# Altium schematic sheet FPGA_Banks_224_225_226_227_228.SchDoc: Sayma AMC
size 420 x 297 mm; $$Internal___BlkDate: 0:12:25_2-9-18; $$Internal_NAME_PLACEHOLDER: a3sheet; $$Internal_Resolution: 00001mm; $$NotCommonProperty_@NAME: FPGA_XCKU040FFVA1156; $$NotCommonProperty_@PRINTORDER: 21; $$NotCommonProperty_@SHEET: FPGA Banks 224 225 226 227 228; $$NotCommonProperty_@SHEETTOTAL: 30; CmpIndex: 924; Drawing Author: G.Kasprowicz; Drawing Number: Sayma AMC; Drawing Project: AMC FMC Carrier Board; Drawing Revision: 2.0; SymIndex: 2141; CheckedBy: P.Kulik,T.Przywozki,W.Ruclo; Author: G.Kasprowicz; CompanyName: WUT ISE; DrawnBy: G.Kasprowicz; Organization: WUT ISE; Address1: PW ISE; Address2: Nowowiejska 15/19 00-665 Warsaw; Address3: gkasprow@gmail.com; DocumentNumber: 29; Revision: 2; SheetNumber: 29; SheetTotal: 32; ModifiedBy: -; CheckedDate: -; Title2: FPGA GTH banks; DivGrp: WUT ISE; Designer: G.Kasprowicz; ModifiedDate: -; ProjectName: Sensor Box
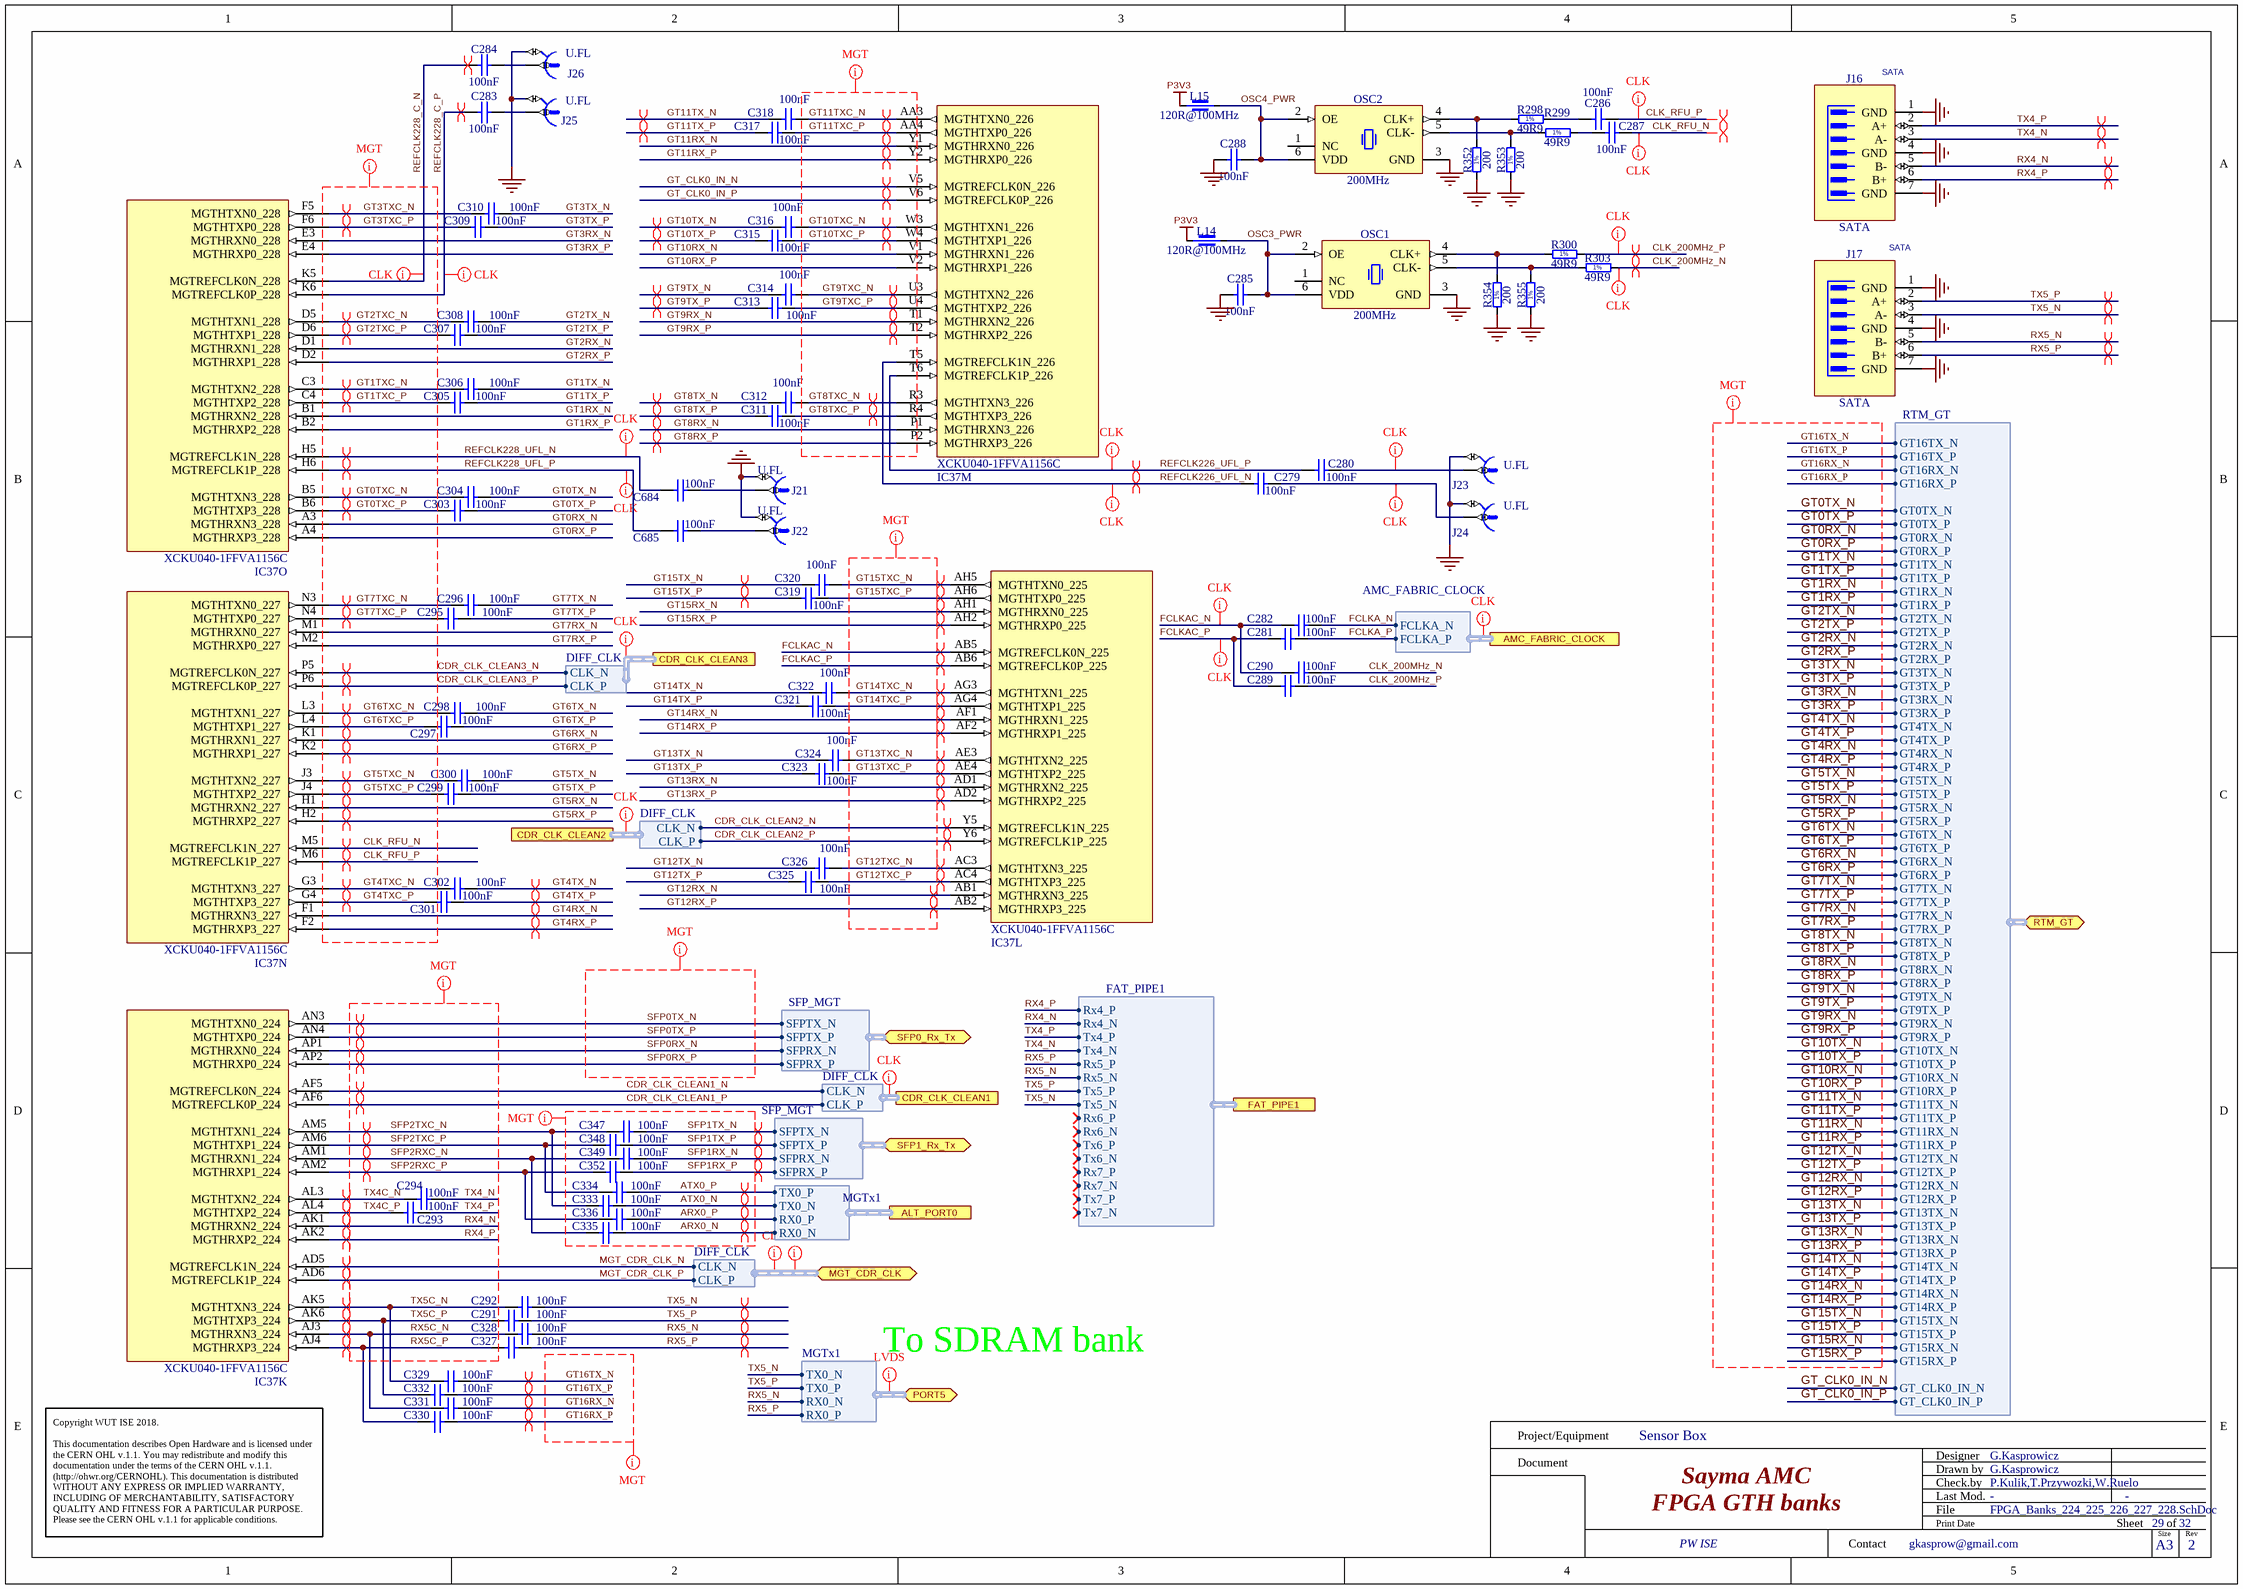
[diagram p0: FPGA_Banks_224_225_226_227_228.SchDoc]

## Parts
C279  100nF  [CAPC0603X33N]
C280  100nF  [CAPC0603X33N]
C281  100nF  [CAPC0603X33N]
C282  100nF  [CAPC0603X33N]
C283  100nF  [CAPC0603X33N]
C284  100nF  [CAPC0603X33N]
C285  100nF  [CAPC0603X33N]
C286  100nF  [CAPC0603X33N]
C287  100nF  [CAPC0603X33N]
C288  100nF  [CAPC0603X33N]
C289  100nF  [CAPC0603X33N]
C290  100nF  [CAPC0603X33N]
C291  100nF  [CAPC0603X33N]
C292  100nF  [CAPC0603X33N]
C293  100nF  [CAPC0603X33N]
C294  100nF  [CAPC0603X33N]
C295  100nF  [CAPC0603X33N]
C296  100nF  [CAPC0603X33N]
C297  100nF  [CAPC0603X33N]
C298  100nF  [CAPC0603X33N]
C299  100nF  [CAPC0603X33N]
C300  100nF  [CAPC0603X33N]
C301  100nF  [CAPC0603X33N]
C302  100nF  [CAPC0603X33N]
C303  100nF  [CAPC0603X33N]
C304  100nF  [CAPC0603X33N]
C305  100nF  [CAPC0603X33N]
C306  100nF  [CAPC0603X33N]
C307  100nF  [CAPC0603X33N]
C308  100nF  [CAPC0603X33N]
C309  100nF  [CAPC0603X33N]
C310  100nF  [CAPC0603X33N]
C311  100nF  [CAPC0603X33N]
C312  100nF  [CAPC0603X33N]
C313  100nF  [CAPC0603X33N]
C314  100nF  [CAPC0603X33N]
C315  100nF  [CAPC0603X33N]
C316  100nF  [CAPC0603X33N]
C317  100nF  [CAPC0603X33N]
C318  100nF  [CAPC0603X33N]
C319  100nF  [CAPC0603X33N]
C320  100nF  [CAPC0603X33N]
C321  100nF  [CAPC0603X33N]
C322  100nF  [CAPC0603X33N]
C323  100nF  [CAPC0603X33N]
C324  100nF  [CAPC0603X33N]
C325  100nF  [CAPC0603X33N]
C326  100nF  [CAPC0603X33N]
C327  100nF  [CAPC0603X33N]
C328  100nF  [CAPC0603X33N]
C329  100nF  [CAPC0603X33N]
C330  100nF  [CAPC0603X33N]
C331  100nF  [CAPC0603X33N]
C332  100nF  [CAPC0603X33N]
C333  100nF  [CAPC0603X33N]
C334  100nF  [CAPC0603X33N]
C335  100nF  [CAPC0603X33N]
C336  100nF  [CAPC0603X33N]
C347  100nF  [CAPC0603X33N]
C348  100nF  [CAPC0603X33N]
C349  100nF  [CAPC0603X33N]
C352  100nF  [CAPC0603X33N]
C684  100nF  [CAPC1005X55N]
C685  100nF  [CAPC1005X55N]
IC37  XCKU040-1FFVA1156C  [BGA1156C100P34X34_3500X3500X350]  (parts K,L,M,N,O of 22)
J16  SATA  [MOLEX_67800-5005]
J17  SATA  [MOLEX_67800-5005]
J21  U.FL  [HIROSE_U.FL-R-SMT-1(10)]
J22  U.FL  [HIROSE_U.FL-R-SMT-1(10)]
J23  U.FL  [HIROSE_U.FL-R-SMT-1(10)]
J24  U.FL  [HIROSE_U.FL-R-SMT-1(10)]
J25  U.FL  [HIROSE_U.FL-R-SMT-1(10)]
J26  U.FL  [HIROSE_U.FL-R-SMT-1(10)]
L14  120R@100MHz  [INDC1005X55N]
L15  120R@100MHz  [INDC1005X55N]
OSC1  200MHz  [OSC_SILICON-LAB_SI510-6N(5X7)]
OSC2  200MHz  [OSC_SILICON-LAB_SI510-6N(5X7)]
R298  49R9  [RESC1005X40N]
R299  49R9  [RESC1005X40N]
R300  49R9  [RESC1005X40N]
R303  49R9  [RESC1005X40N]
R352  200  [RESC1005X40N]
R353  200  [RESC1005X40N]
R354  200  [RESC1005X40N]
R355  200  [RESC1005X40N]

## Ports
ALT_PORT0 (harness MGTx1), AMC_FABRIC_CLOCK (harness AMC_FABRIC_CLOCK), CDR_CLK_CLEAN1 (harness DIFF_CLK), CDR_CLK_CLEAN2 (harness DIFF_CLK), CDR_CLK_CLEAN3 (harness DIFF_CLK), FAT_PIPE1 (harness FAT_PIPE1), MGT_CDR_CLK (bidir, harness DIFF_CLK), PORT5 (bidir, harness MGTx1), RTM_GT (bidir, harness RTM_GT), SFP0_Rx_Tx (bidir, harness SFP_MGT), SFP1_Rx_Tx (bidir, harness SFP_MGT)

## Harnesses
SFP_MGT: SFPRX_P, SFPRX_N, SFPTX_P, SFPTX_N
FAT_PIPE1: Rx4_P, Rx4_N, Tx4_N, Tx4_P, Rx5_P, Rx5_N, Tx5_N, Tx5_P, Rx6_P, Rx6_N, Tx6_P, Rx7_P, Rx7_N, Tx7_P, Tx6_N, Tx7_N
AMC_FABRIC_CLOCK: FCLKA_N, FCLKA_P
RTM_GT: GT0TX_N, GT0TX_P, GT0RX_N, GT0RX_P, GT1TX_N, GT1TX_P, GT1RX_N, GT1RX_P, GT2TX_N, GT2TX_P, GT2RX_N, GT2RX_P, GT3TX_N, GT3TX_P, GT3RX_N, GT3RX_P, GT4TX_N, GT4TX_P, GT4RX_N, GT4RX_P, GT5TX_N, GT5TX_P, GT5RX_N, GT5RX_P, GT6TX_N, GT6TX_P, GT6RX_N, GT6RX_P, GT7TX_N, GT7TX_P, GT7RX_N, GT7RX_P, GT8TX_N, GT8TX_P, GT8RX_N, GT8RX_P, GT9TX_N, GT9TX_P, GT9RX_N, GT9RX_P, GT10TX_N, GT10TX_P, GT10RX_N, GT10RX_P, GT11TX_N, GT11TX_P, GT11RX_N, GT11RX_P, GT12TX_N, GT12TX_P, GT12RX_N, GT12RX_P, GT13TX_N, GT13TX_P, GT13RX_N, GT13RX_P, GT14TX_N, GT14TX_P, GT14RX_N, GT14RX_P, GT15TX_N, GT15TX_P, GT15RX_N, GT15RX_P, GT_CLK0_IN_N, GT_CLK0_IN_P, GT16TX_N, GT16TX_P, GT16RX_N, GT16RX_P
DIFF_CLK: CLK_N, CLK_P
MGTx1: RX0_P, RX0_N, TX0_P, TX0_N
DIFF_CLK: CLK_P, CLK_N

## Nets
GND: C285.1 C288.1 J16.1(GND) J16.4(GND) J16.7(GND) J17.1(GND) J17.4(GND) J17.7(GND) J21.2 J22.2 J23.2 J24.2 J25.2 J26.2 OSC1.3(GND) OSC2.3(GND) R352.1 R353.1 R354.1 R355.1
P3V3: L14.2 L15.2
ARX0_N: C335.2 ; port ALT_PORT0.RX0_N
ARX0_P: C336.2 ; port ALT_PORT0.RX0_P
ATX0_N: C333.2 ; port ALT_PORT0.TX0_N
ATX0_P: C334.2 ; port ALT_PORT0.TX0_P
CDR_CLK_CLEAN1_N: IC37.AF5(MGTREFCLK0N_224) ; port CDR_CLK_CLEAN1.CLK_N
CDR_CLK_CLEAN1_P: IC37.AF6(MGTREFCLK0P_224) ; port CDR_CLK_CLEAN1.CLK_P
CDR_CLK_CLEAN2_N: IC37.Y5(MGTREFCLK1N_225) ; port CDR_CLK_CLEAN2.CLK_N
CDR_CLK_CLEAN2_P: IC37.Y6(MGTREFCLK1P_225) ; port CDR_CLK_CLEAN2.CLK_P
CDR_CLK_CLEAN3_N: IC37.P5(MGTREFCLK0N_227) ; port CDR_CLK_CLEAN3.CLK_N
CDR_CLK_CLEAN3_P: IC37.P6(MGTREFCLK0P_227) ; port CDR_CLK_CLEAN3.CLK_P
CLK_200MHz_N: C290.2 R303.2
CLK_200MHz_P: C289.2 R300.2
CLK_RFU_N: C287.2 IC37.M5(MGTREFCLK1N_227)
CLK_RFU_P: C286.2 IC37.M6(MGTREFCLK1P_227)
FCLKA_N: C282.2 ; port AMC_FABRIC_CLOCK.FCLKA_N
FCLKA_P: C281.2 ; port AMC_FABRIC_CLOCK.FCLKA_P
FCLKAC_N: C282.1 C290.1 IC37.AB5(MGTREFCLK0N_225)
FCLKAC_P: C281.1 C289.1 IC37.AB6(MGTREFCLK0P_225)
GT0RX_N: IC37.A3(MGTHRXN3_228) ; port RTM_GT.GT0RX_N
GT0RX_P: IC37.A4(MGTHRXP3_228) ; port RTM_GT.GT0RX_P
GT0TX_N: C304.2 ; port RTM_GT.GT0TX_N
GT0TX_P: C303.2 ; port RTM_GT.GT0TX_P
GT0TXC_N: C304.1 IC37.B5(MGTHTXN3_228)
GT0TXC_P: C303.1 IC37.B6(MGTHTXP3_228)
GT1RX_N: IC37.B1(MGTHRXN2_228) ; port RTM_GT.GT1RX_N
GT1RX_P: IC37.B2(MGTHRXP2_228) ; port RTM_GT.GT1RX_P
GT1TX_N: C306.2 ; port RTM_GT.GT1TX_N
GT1TX_P: C305.2 ; port RTM_GT.GT1TX_P
GT1TXC_N: C306.1 IC37.C3(MGTHTXN2_228)
GT1TXC_P: C305.1 IC37.C4(MGTHTXP2_228)
GT2RX_N: IC37.D1(MGTHRXN1_228) ; port RTM_GT.GT2RX_N
GT2RX_P: IC37.D2(MGTHRXP1_228) ; port RTM_GT.GT2RX_P
GT2TX_N: C308.2 ; port RTM_GT.GT2TX_N
GT2TX_P: C307.2 ; port RTM_GT.GT2TX_P
GT2TXC_N: C308.1 IC37.D5(MGTHTXN1_228)
GT2TXC_P: C307.1 IC37.D6(MGTHTXP1_228)
GT3RX_N: IC37.E3(MGTHRXN0_228) ; port RTM_GT.GT3RX_N
GT3RX_P: IC37.E4(MGTHRXP0_228) ; port RTM_GT.GT3RX_P
GT3TX_N: C310.2 ; port RTM_GT.GT3TX_N
GT3TX_P: C309.2 ; port RTM_GT.GT3TX_P
GT3TXC_N: C310.1 IC37.F5(MGTHTXN0_228)
GT3TXC_P: C309.1 IC37.F6(MGTHTXP0_228)
GT4RX_N: IC37.F1(MGTHRXN3_227) ; port RTM_GT.GT4RX_N
GT4RX_P: IC37.F2(MGTHRXP3_227) ; port RTM_GT.GT4RX_P
GT4TX_N: C302.2 ; port RTM_GT.GT4TX_N
GT4TX_P: C301.2 ; port RTM_GT.GT4TX_P
GT4TXC_N: C302.1 IC37.G3(MGTHTXN3_227)
GT4TXC_P: C301.1 IC37.G4(MGTHTXP3_227)
GT5RX_N: IC37.H1(MGTHRXN2_227) ; port RTM_GT.GT5RX_N
GT5RX_P: IC37.H2(MGTHRXP2_227) ; port RTM_GT.GT5RX_P
GT5TX_N: C300.2 ; port RTM_GT.GT5TX_N
GT5TX_P: C299.2 ; port RTM_GT.GT5TX_P
GT5TXC_N: C300.1 IC37.J3(MGTHTXN2_227)
GT5TXC_P: C299.1 IC37.J4(MGTHTXP2_227)
GT6RX_N: IC37.K1(MGTHRXN1_227) ; port RTM_GT.GT6RX_N
GT6RX_P: IC37.K2(MGTHRXP1_227) ; port RTM_GT.GT6RX_P
GT6TX_N: C298.2 ; port RTM_GT.GT6TX_N
GT6TX_P: C297.2 ; port RTM_GT.GT6TX_P
GT6TXC_N: C298.1 IC37.L3(MGTHTXN1_227)
GT6TXC_P: C297.1 IC37.L4(MGTHTXP1_227)
GT7RX_N: IC37.M1(MGTHRXN0_227) ; port RTM_GT.GT7RX_N
GT7RX_P: IC37.M2(MGTHRXP0_227) ; port RTM_GT.GT7RX_P
GT7TX_N: C296.2 ; port RTM_GT.GT7TX_N
GT7TX_P: C295.2 ; port RTM_GT.GT7TX_P
GT7TXC_N: C296.1 IC37.N3(MGTHTXN0_227)
GT7TXC_P: C295.1 IC37.N4(MGTHTXP0_227)
GT8RX_N: IC37.P1(MGTHRXN3_226) ; port RTM_GT.GT8RX_N
GT8RX_P: IC37.P2(MGTHRXP3_226) ; port RTM_GT.GT8RX_P
GT8TX_N: C312.1 ; port RTM_GT.GT8TX_N
GT8TX_P: C311.1 ; port RTM_GT.GT8TX_P
GT8TXC_N: C312.2 IC37.R3(MGTHTXN3_226)
GT8TXC_P: C311.2 IC37.R4(MGTHTXP3_226)
GT9RX_N: IC37.T1(MGTHRXN2_226) ; port RTM_GT.GT9RX_N
GT9RX_P: IC37.T2(MGTHRXP2_226) ; port RTM_GT.GT9RX_P
GT9TX_N: C314.1 ; port RTM_GT.GT9TX_N
GT9TX_P: C313.1 ; port RTM_GT.GT9TX_P
GT9TXC_N: C314.2 IC37.U3(MGTHTXN2_226)
GT9TXC_P: C313.2 IC37.U4(MGTHTXP2_226)
GT10RX_N: IC37.V1(MGTHRXN1_226) ; port RTM_GT.GT10RX_N
GT10RX_P: IC37.V2(MGTHRXP1_226) ; port RTM_GT.GT10RX_P
GT10TX_N: C316.1 ; port RTM_GT.GT10TX_N
GT10TX_P: C315.1 ; port RTM_GT.GT10TX_P
GT10TXC_N: C316.2 IC37.W3(MGTHTXN1_226)
GT10TXC_P: C315.2 IC37.W4(MGTHTXP1_226)
GT11RX_N: IC37.Y1(MGTHRXN0_226) ; port RTM_GT.GT11RX_N
GT11RX_P: IC37.Y2(MGTHRXP0_226) ; port RTM_GT.GT11RX_P
GT11TX_N: C318.1 ; port RTM_GT.GT11TX_N
GT11TX_P: C317.1 ; port RTM_GT.GT11TX_P
GT11TXC_N: C318.2 IC37.AA3(MGTHTXN0_226)
GT11TXC_P: C317.2 IC37.AA4(MGTHTXP0_226)
GT12RX_N: IC37.AB1(MGTHRXN3_225) ; port RTM_GT.GT12RX_N
GT12RX_P: IC37.AB2(MGTHRXP3_225) ; port RTM_GT.GT12RX_P
GT12TX_N: C326.1 ; port RTM_GT.GT12TX_N
GT12TX_P: C325.1 ; port RTM_GT.GT12TX_P
GT12TXC_N: C326.2 IC37.AC3(MGTHTXN3_225)
GT12TXC_P: C325.2 IC37.AC4(MGTHTXP3_225)
GT13RX_N: IC37.AD1(MGTHRXN2_225) ; port RTM_GT.GT13RX_N
GT13RX_P: IC37.AD2(MGTHRXP2_225) ; port RTM_GT.GT13RX_P
GT13TX_N: C324.1 ; port RTM_GT.GT13TX_N
GT13TX_P: C323.1 ; port RTM_GT.GT13TX_P
GT13TXC_N: C324.2 IC37.AE3(MGTHTXN2_225)
GT13TXC_P: C323.2 IC37.AE4(MGTHTXP2_225)
GT14RX_N: IC37.AF1(MGTHRXN1_225) ; port RTM_GT.GT14RX_N
GT14RX_P: IC37.AF2(MGTHRXP1_225) ; port RTM_GT.GT14RX_P
GT14TX_N: C322.1 ; port RTM_GT.GT14TX_N
GT14TX_P: C321.1 ; port RTM_GT.GT14TX_P
GT14TXC_N: C322.2 IC37.AG3(MGTHTXN1_225)
GT14TXC_P: C321.2 IC37.AG4(MGTHTXP1_225)
GT15RX_N: IC37.AH1(MGTHRXN0_225) ; port RTM_GT.GT15RX_N
GT15RX_P: IC37.AH2(MGTHRXP0_225) ; port RTM_GT.GT15RX_P
GT15TX_N: C320.1 ; port RTM_GT.GT15TX_N
GT15TX_P: C319.1 ; port RTM_GT.GT15TX_P
GT15TXC_N: C320.2 IC37.AH5(MGTHTXN0_225)
GT15TXC_P: C319.2 IC37.AH6(MGTHTXP0_225)
GT16RX_N: C331.2 ; port RTM_GT.GT16RX_N
GT16RX_P: C330.2 ; port RTM_GT.GT16RX_P
GT16TX_N: C329.2 ; port RTM_GT.GT16TX_N
GT16TX_P: C332.2 ; port RTM_GT.GT16TX_P
GT_CLK0_IN_N: IC37.V5(MGTREFCLK0N_226) ; port RTM_GT.GT_CLK0_IN_N
GT_CLK0_IN_P: IC37.V6(MGTREFCLK0P_226) ; port RTM_GT.GT_CLK0_IN_P
MGT_CDR_CLK_N: IC37.AD5(MGTREFCLK1N_224) ; port MGT_CDR_CLK.CLK_N
MGT_CDR_CLK_P: IC37.AD6(MGTREFCLK1P_224) ; port MGT_CDR_CLK.CLK_P
OSC3_PWR: C285.2 L14.1 OSC1.2(OE) OSC1.6(VDD)
OSC4_PWR: C288.2 L15.1 OSC2.2(OE) OSC2.6(VDD)
REFCLK226_UFL_N: C279.1 IC37.T5(MGTREFCLK1N_226)
REFCLK226_UFL_P: C280.1 IC37.T6(MGTREFCLK1P_226)
REFCLK228_C_N: C284.1 IC37.K5(MGTREFCLK0N_228)
REFCLK228_C_P: C283.1 IC37.K6(MGTREFCLK0P_228)
REFCLK228_UFL_N: C684.2 IC37.H5(MGTREFCLK1N_228)
REFCLK228_UFL_P: C685.2 IC37.H6(MGTREFCLK1P_228)
RX4_N: IC37.AK1(MGTHRXN2_224) J16.5(B-) ; port FAT_PIPE1.Rx4_N
RX4_P: IC37.AK2(MGTHRXP2_224) J16.6(B+) ; port FAT_PIPE1.Rx4_P
RX5_N: C328.2 J17.5(B-) ; port FAT_PIPE1.Rx5_N, port PORT5.RX0_N
RX5_P: C327.2 J17.6(B+) ; port FAT_PIPE1.Rx5_P, port PORT5.RX0_P
RX5C_N: C328.1 C331.1 IC37.AJ3(MGTHRXN3_224)
RX5C_P: C327.1 C330.1 IC37.AJ4(MGTHRXP3_224)
SFP0RX_N: IC37.AP1(MGTHRXN0_224) ; port SFP0_Rx_Tx.SFPRX_N
SFP0RX_P: IC37.AP2(MGTHRXP0_224) ; port SFP0_Rx_Tx.SFPRX_P
SFP0TX_N: IC37.AN3(MGTHTXN0_224) ; port SFP0_Rx_Tx.SFPTX_N
SFP0TX_P: IC37.AN4(MGTHTXP0_224) ; port SFP0_Rx_Tx.SFPTX_P
SFP1RX_N: C349.2 ; port SFP1_Rx_Tx.SFPRX_N
SFP1RX_P: C352.2 ; port SFP1_Rx_Tx.SFPRX_P
SFP1TX_N: C347.2 ; port SFP1_Rx_Tx.SFPTX_N
SFP1TX_P: C348.2 ; port SFP1_Rx_Tx.SFPTX_P
SFP2RXC_N: C335.1 C349.1 IC37.AM1(MGTHRXN1_224)
SFP2RXC_P: C336.1 C352.1 IC37.AM2(MGTHRXP1_224)
SFP2TXC_N: C333.1 C347.1 IC37.AM5(MGTHTXN1_224)
SFP2TXC_P: C334.1 C348.1 IC37.AM6(MGTHTXP1_224)
TX4_N: C294.2 J16.3(A-) ; port FAT_PIPE1.Tx4_N
TX4_P: C293.2 J16.2(A+) ; port FAT_PIPE1.Tx4_P
TX4C_N: C294.1 IC37.AL3(MGTHTXN2_224)
TX4C_P: C293.1 IC37.AL4(MGTHTXP2_224)
TX5_N: C292.2 J17.3(A-) ; port FAT_PIPE1.Tx5_N, port PORT5.TX0_N
TX5_P: C291.2 J17.2(A+) ; port FAT_PIPE1.Tx5_P, port PORT5.TX0_P
TX5C_N: C292.1 C329.1 IC37.AK5(MGTHTXN3_224)
TX5C_P: C291.1 C332.1 IC37.AK6(MGTHTXP3_224)
NetC279_2: C279.2 J24.1
NetC280_2: C280.2 J23.1
NetC283_2: C283.2 J25.1
NetC284_2: C284.2 J26.1
NetC286_1: C286.1 R298.2
NetC287_1: C287.1 R299.2
NetC684_1: C684.1 J21.1
NetC685_1: C685.1 J22.1
NetOSC1_4: OSC1.4(CLK+) R300.1 R354.2
NetOSC1_5: OSC1.5(CLK-) R303.1 R355.2
NetOSC2_4: OSC2.4(CLK+) R298.1 R352.2
NetOSC2_5: OSC2.5(CLK-) R299.1 R353.2

Not connected (* = marked no-connect by the designer): OSC1 1(NC); OSC2 1(NC)

## Layout directives
differential pair: ARX0_N, ARX0_P, ATX0_N, ATX0_P, CDR_CLK_CLEAN1_N, CDR_CLK_CLEAN1_P, CDR_CLK_CLEAN2_N, CDR_CLK_CLEAN2_P, CDR_CLK_CLEAN3_N, CDR_CLK_CLEAN3_P, CLK_200MHz_N, CLK_200MHz_P, CLK_RFU_N, CLK_RFU_P, FCLKAC_N, FCLKAC_P, GT0TXC_N, GT0TXC_P, GT1TXC_N, GT1TXC_P, GT2TXC_N, GT2TXC_P, GT3TXC_N, GT3TXC_P, GT4RX_N, GT4RX_P, GT4TX_N, GT4TX_P, GT4TXC_N, GT4TXC_P, GT5RX_N, GT5RX_P, GT5TXC_N, GT5TXC_P, GT6RX_N, GT6RX_P, GT6TXC_N, GT6TXC_P, GT7TXC_N, GT7TXC_P, GT8RX_N, GT8RX_P, GT8TX_N, GT8TX_P, GT8TXC_N, GT8TXC_P, GT9RX_N, GT9RX_P, GT9TX_N, GT9TX_P, GT9TXC_N, GT9TXC_P, GT10TX_N, GT10TX_P, GT10TXC_N, GT10TXC_P, GT11RX_N, GT11RX_P, GT11TX_N, GT11TX_P, GT11TXC_N, GT11TXC_P, GT12RX_N, GT12RX_P, GT12TXC_N, GT12TXC_P, GT13RX_N, GT13RX_P, GT13TXC_N, GT13TXC_P, GT14RX_N, GT14RX_P, GT14TXC_N, GT14TXC_P, GT15RX_N, GT15RX_P, GT15TX_N, GT15TX_P, GT15TXC_N, GT15TXC_P, GT16RX_N, GT16RX_P, GT16TX_N, GT16TX_P, GT_CLK0_IN_N, GT_CLK0_IN_P, MGT_CDR_CLK_N, MGT_CDR_CLK_P, REFCLK226_UFL_N, REFCLK226_UFL_P, REFCLK228_C_N, REFCLK228_C_P, REFCLK228_UFL_N, REFCLK228_UFL_P, RX4_N, RX4_P, RX5_N, RX5_P, RX5C_N, RX5C_P, SFP0RX_N, SFP0RX_P, SFP0TX_N, SFP0TX_P, SFP1RX_N, SFP1RX_P, SFP1TX_N, SFP1TX_P, SFP2RXC_N, SFP2RXC_P, SFP2TXC_N, SFP2TXC_P, TX4_N, TX4_P, TX4C_N, TX4C_P, TX5_N, TX5_P, TX5C_N, TX5C_P
net class MGT: ARX0_N, ARX0_P, ATX0_N, ATX0_P, CDR_CLK_CLEAN3_N, CDR_CLK_CLEAN3_P, CLK_RFU_N, CLK_RFU_P, GT0RX_N, GT0RX_P, GT0TX_N, GT0TX_P, GT0TXC_N, GT0TXC_P, GT1RX_N, GT1RX_P, GT1TX_N, GT1TX_P, GT1TXC_N, GT1TXC_P, GT2RX_N, GT2RX_P, GT2TX_N, GT2TX_P, GT2TXC_N, GT2TXC_P, GT3RX_N, GT3RX_P, GT3TX_N, GT3TX_P, GT3TXC_N, GT3TXC_P, GT4RX_N, GT4RX_P, GT4TX_N, GT4TX_P, GT4TXC_N, GT4TXC_P, GT5RX_N, GT5RX_P, GT5TX_N, GT5TX_P, GT5TXC_N, GT5TXC_P, GT6RX_N, GT6RX_P, GT6TX_N, GT6TX_P, GT6TXC_N, GT6TXC_P, GT7RX_N, GT7RX_P, GT7TX_N, GT7TX_P, GT7TXC_N, GT7TXC_P, GT8RX_N, GT8RX_P, GT8TX_N, GT8TX_P, GT8TXC_N, GT8TXC_P, GT9RX_N, GT9RX_P, GT9TX_N, GT9TX_P, GT9TXC_N, GT9TXC_P, GT10RX_N, GT10RX_P, GT10TX_N, GT10TX_P, GT10TXC_N, GT10TXC_P, GT11RX_N, GT11RX_P, GT11TX_N, GT11TX_P, GT11TXC_N, GT11TXC_P, GT12RX_N, GT12RX_P, GT12TX_N, GT12TX_P, GT12TXC_N, GT12TXC_P, GT13RX_N, GT13RX_P, GT13TX_N, GT13TX_P, GT13TXC_N, GT13TXC_P, GT14RX_N, GT14RX_P, GT14TX_N, GT14TX_P, GT14TXC_N, GT14TXC_P, GT15RX_N, GT15RX_P, GT15TX_N, GT15TX_P, GT15TXC_N, GT15TXC_P, GT16RX_N, GT16RX_P, GT16TX_N, GT16TX_P, RX4_N, RX4_P, RX5C_N, RX5C_P, SFP0RX_N, SFP0RX_P, SFP0TX_N, SFP0TX_P, SFP1RX_N, SFP1RX_P, SFP1TX_N, SFP1TX_P, SFP2RXC_N, SFP2RXC_P, SFP2TXC_N, SFP2TXC_P, TX4_N, TX4_P, TX4C_N, TX4C_P, TX5C_N, TX5C_P
net class LVDS: (no net found under the mark)
net class CLK: (no net found under the mark), CLK_200MHz_N, CLK_200MHz_P, CLK_RFU_N, CLK_RFU_P, FCLKAC_N, FCLKAC_P, NetC279_2, NetC280_2, REFCLK226_UFL_N, REFCLK226_UFL_P, REFCLK228_C_N, REFCLK228_C_P, REFCLK228_UFL_N, REFCLK228_UFL_P

## Notes on the sheet
- (near J16) SATA
- SATA
- To SDRAM bank
- Project/Equipment
- Document
- Designer
- Drawn by
- Check.by
- Copyright WUT ISE 2018.
  This documentation describes Open Hardware and is licensed under the CERN OHL v.1.1. You may redistribute and modify this documentation under the terms of the CERN OHL v.1.1. (http://ohwr.org/CERNOHL). This documentation is distributed WITHOUT ANY EXPRESS OR IMPLIED WARRANTY, INCLUDING OF MERCHANTABILITY, SATISFACTORY QUALITY AND FITNESS FOR A PARTICULAR PURPOSE. Please see the CERN OHL v.1.1 for applicable conditions.
- Contact
- File
- Last Mod.
- Print Date
- Sheet
- Size
- A3
- of
- Rev
- (in symbol R0402_49R9_1%_0.0625W_100PPM) 1%
- (in symbol R0402_200R_1%_0.0625W_100PPM) 1%

## Library data of the parts
C279-C336 C347-C349 C352 = CC0201_100NF_6.3V_10%_X5R: Non-polarised capacitor; Manufacturer: GENERIC; Part Description: SMD Multilayer Chip Ceramic Capacitor; Manufacturer1 Part Number: 02016D104KAT2A; Tolerance: ±10%; Voltage: 6.3V; TC: X5R; Manufacturer Part Number: CC0201_100NF_6.3V_10%_X5R; Part Number: CC0201_100NF_6.3V_10%_X5R; Value: 100nF; Component Kind: Standard; Component Type: Standard; Pin Count: 2; Status: Not Recommended; Case: 0201; Mounted: Yes; Socket: No; SMD: Yes; Sense: No; Manufacturer1 Example: AVX; Manufacturer1 ComponentHeight: 0.33mm; HelpURL: \\cern.ch\dfs\Applications\Altium\Datasheets\CC0201_X5R_AVX.pdf; Author: CERN DEM JLC; CreateDate: 03.12.2007; LatestRevisionDate: 03.12.2007
C684 C685 = CC0402_100NF_16V_10%_X5R: Non-polarised capacitor; Manufacturer: GENERIC; Manufacturer1 Part Number: GRM155R61C104KA88D; Part Description: SMD Multilayer Chip Ceramic Capacitor; TC: X5R; Tolerance: ±10%; Voltage: 16V; Case: 0402; Manufacturer Part Number: CC0402_100NF_16V_10%_X5R; Manufacturer1 Example: MURATA; Part Number: CC0402_100NF_16V_10%_X5R; Pin Count: 2; SMD: Yes; Status: None; Value: 100nF; Component Kind: Standard; Component Type: Standard; Mounted: Yes; Socket: No; Sense: No; Manufacturer1 ComponentHeight: 0.55mm; HelpURL: \\cern.ch\dfs\Applications\Altium\Datasheets\CC0402_X5R_MURATA_GRM.pdf; Author: CERN DEM JLC; CreateDate: 10.12.2013; LatestRevisionDate: 10.12.2013
IC37 = XCKU040-1FFVA1156C: Kintex UltraScale FPGA, 520 I/O, 530K Cells, 1156-Ball BGA, Speed Grade 1, Commercial Grade; Manufacturer: XILINX; Part Description: Kintex UltraScale, 40 DLL I/O, 416 HP I/O, 104 HR I/O, 1156-Pin BGA, Speed Grade 1, Commercial Grade; PressFit: No; Bonding: No; PackageDescription: BGA, 1.00mm Pitch, Square; 1156 Pin, 34 Columns X 34 Rows, Body 35.00mm X 35.00mm X 3.50mm H, IPC Medium Density; Part Number: XCKU040-1FFVA1156C; Component Kind: Standard; Component Type: Standard; Device: XCKU040-1FFVA1156C; Manufacturer Part Number: XCKU040-1FFVA1156C; Pin Count: 1156; Case: BGA1156; Mounted: Yes; Socket: No; SMD: Yes; Sense: No; ComponentHeight: 3.5mm; HelpURL: \\cern.ch\dfs\Applications\Altium\Datasheets\XCKU040-1FFVA1156C.pdf; ComponentLink1URL: \\cern.ch\dfs\Applications\Altium\Datasheets\XCKU040-1FFVA1156C_Package-Pinout.pdf; ComponentLink1Description: Package/Pinout; Author: CERN DEM CA; CreateDate: 16.08.2016; LatestRevisionDate: 16.08.2016
J16 J17 = MOLEX_67800-5005: 7 Pin SATA Receptacle; Manufacturer: MOLEX; Part Description: 1.27mm Pitch, 7 Contacts, Serial ATA High Speed Header, Straight with Locking Latch; PressFit: No; Manufacturer Part Number: 67800-5005; Part Number: MOLEX_67800-5005; Component Kind: Standard; Component Type: Standard; Pin Count: 7; Family: SATA; Mounted: Yes; Socket: No; SMD: Yes; Sense: No; Status: None; ComponentHeight: 8.4mm; HelpURL: \\cern.ch\dfs\Applications\Altium\Datasheets\MOLEX_67800-5005.pdf; Author: CERN DEM MR; CreateDate: 01.12.2016; LatestRevisionDate: 01.12.2016
J21 J22 = HIROSE_U.FL-R-SMT-1(10): Part Description: Up to 6GHz Ultra Small Surface Mount Male Coaxial Connectors U.FL Series; Manufacturer: HIROSE (HRS); PressFit: No; Part Number: HIROSE_U.FL-R-SMT-1(10); Component Kind: Standard; Component Type: Standard; Pin Count: 2; Family: U.FL; Mounted: Yes; Socket: No; SMD: Yes; Sense: No; Status: None; Manufacturer Part Number: U.FL-R-SMT-1(10); ComponentHeight: 1.25mm; HelpURL: \\cern.ch\dfs\Applications\Altium\Datasheets\HIROSE_U.FL-R-SMT-1(10).pdf; Author: CERN DEM JLC; CreateDate: 24.03.2010; LatestRevisionDate: 24.03.2010
J23-J26 = HIROSE_U.FL-R-SMT-1(10): Manufacturer: HIROSE (HRS); Part Description: Up to 6GHz Ultra Small Surface Mount Male Coaxial Connectors U.FL Series; PressFit: No; Manufacturer Part Number: U.FL-R-SMT-1(10); Part Number: HIROSE_U.FL-R-SMT-1(10); Component Kind: Standard; Component Type: Standard; Pin Count: 2; Family: U.FL; Mounted: Yes; Socket: No; SMD: Yes; Sense: No; Status: None; ComponentHeight: 1.25mm; HelpURL: \\cern.ch\dfs\Applications\Altium\Datasheets\HIROSE_U.FL-R-SMT-1(10).pdf; Author: CERN DEM JLC; CreateDate: 24.03.2010; LatestRevisionDate: 24.03.2010
L14 L15 = IND0402_MURATA_BLM15PX121SN1D: Manufacturer: MURATA; Part Description: SMD EMIFIL Chip Ferrite Bead; Tolerance: ±25%; Power: 2A; Resistance: 0.055R; Manufacturer Part Number: BLM15PX121SN1D; Part Number: IND0402_MURATA_BLM15PX121SN1D; Value: 120R@100MHz; Component Kind: Standard; Component Type: Standard; Pin Count: 2; Status: None; Case: 0402; Mounted: Yes; Socket: No; SMD: Yes; Sense: No; ComponentHeight: 0.55mm; HelpURL: \\cern.ch\dfs\Applications\Altium\Datasheets\IND0402_MURATA_BLM15PX.pdf; Author: CERN DEM JMW; CreateDate: 19.02.2014; LatestRevisionDate: 25.10.2018
OSC1 OSC2 = OSC_200MHZ_SILICON-LAB_510ABA200M000AAG: Crystal Oscillator 6 pins, Si510 (LVDS/LVPECL/HCSL/Dual CMOS); Manufacturer: SILICON LABS; Part Description: crystal oscillator, 200MHz, 100ppm, 3.3V, LVDS, 5x7mm; PressFit: No; Bonding: No; Manufacturer Part Number: 510ABA200M000AAG; PackageDescription: Oscillator Si510 Series, 6 pins, 5x7mm; Part Number: OSC_200MHZ_SILICON-LAB_510ABA200M000AAG; Value: 200MHz; Component Kind: Standard; Component Type: Standard; Pin Count: 6; Mounted: Yes; Socket: No; SMD: Yes; Sense: No; ComponentHeight: 1.8mm; HelpURL: \\cern.ch\dfs\Applications\Altium\Datasheets\OSC_SILICON-LAB_SI510.pdf; Author: GK; CreateDate: 10.08.2015; LatestRevisionDate: 26.11.2018
R298-R300 R303 = R0402_49R9_1%_0.0625W_100PPM: Resistor - 1%; Manufacturer: GENERIC; Part Description: General Purpose Thick Film Chip Resistor; Manufacturer1 Part Number: 232270674999L or RC0402FR-0749R9L; TC: ±100ppm/°C; PressFit: No; Manufacturer Part Number: R0402_49R9_1%_0.0625W_100PPM; Part Number: R0402_49R9_1%_0.0625W_100PPM; Tolerance: ±1%; Value: 49R9; Component Kind: Standard; Component Type: Standard; Pin Count: 2; Status: Not Recommended; Power: 0.0625W; Case: 0402; Mounted: Yes; Sense: No; Socket: No; SMD: Yes; Manufacturer1 Example: YAGEO PHYCOMP; Manufacturer1 ComponentHeight: 0.4mm; HelpURL: \\cern.ch\dfs\Applications\Altium\Datasheets\R0402_Phycomp_RC0402.pdf; Author: CERN DEM JLC; CreateDate: 24.10.2012; LatestRevisionDate: 24.10.2012
R352-R355 = R0402_200R_1%_0.0625W_100PPM: Resistor - 1%; Manufacturer: GENERIC; Part Description: General Purpose Thick Film Chip Resistor; Manufacturer1 Part Number: 232270672001L; TC: ±100ppm/°C; PressFit: No; Manufacturer Part Number: R0402_200R_1%_0.0625W_100PPM; Part Number: R0402_200R_1%_0.0625W_100PPM; Tolerance: ±1%; Value: 200; Component Kind: Standard; Component Type: Standard; Pin Count: 2; Status: Not Recommended; Power: 0.0625W; Case: 0402; Mounted: Yes; Sense: No; Socket: No; SMD: Yes; Manufacturer1 Example: YAGEO PHYCOMP; Manufacturer1 ComponentHeight: 0.4mm; HelpURL: \\cern.ch\dfs\Applications\Altium\Datasheets\R0402_Phycomp_RC0402.pdf; Author: CERN DEM JLC; CreateDate: 03.12.2007; LatestRevisionDate: 17.10.2012